# EAGLE design Charge Board (EAGLE 6.3)
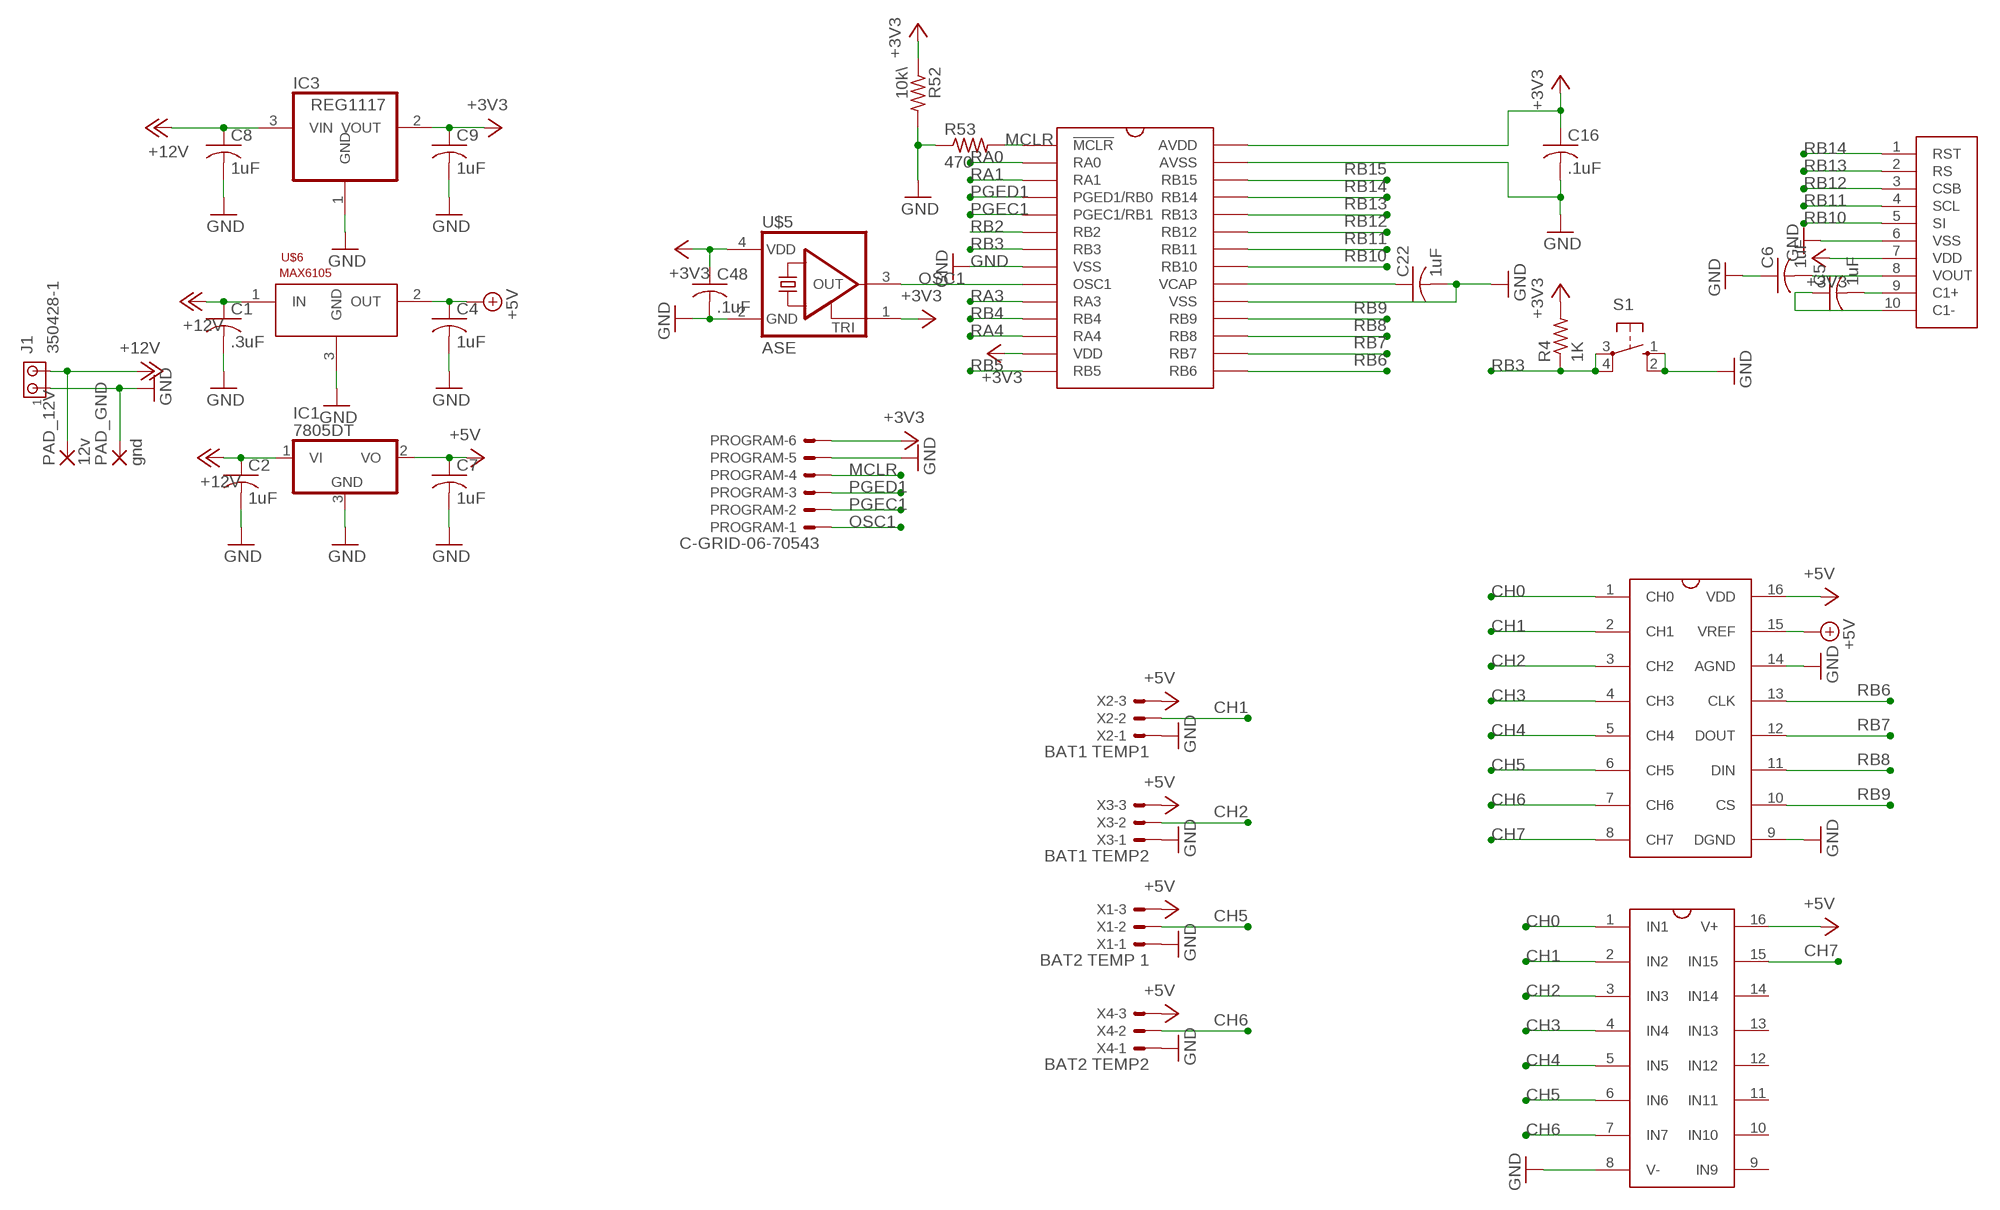
[diagram p0: schematic, sheet 1, part 1 of 2]
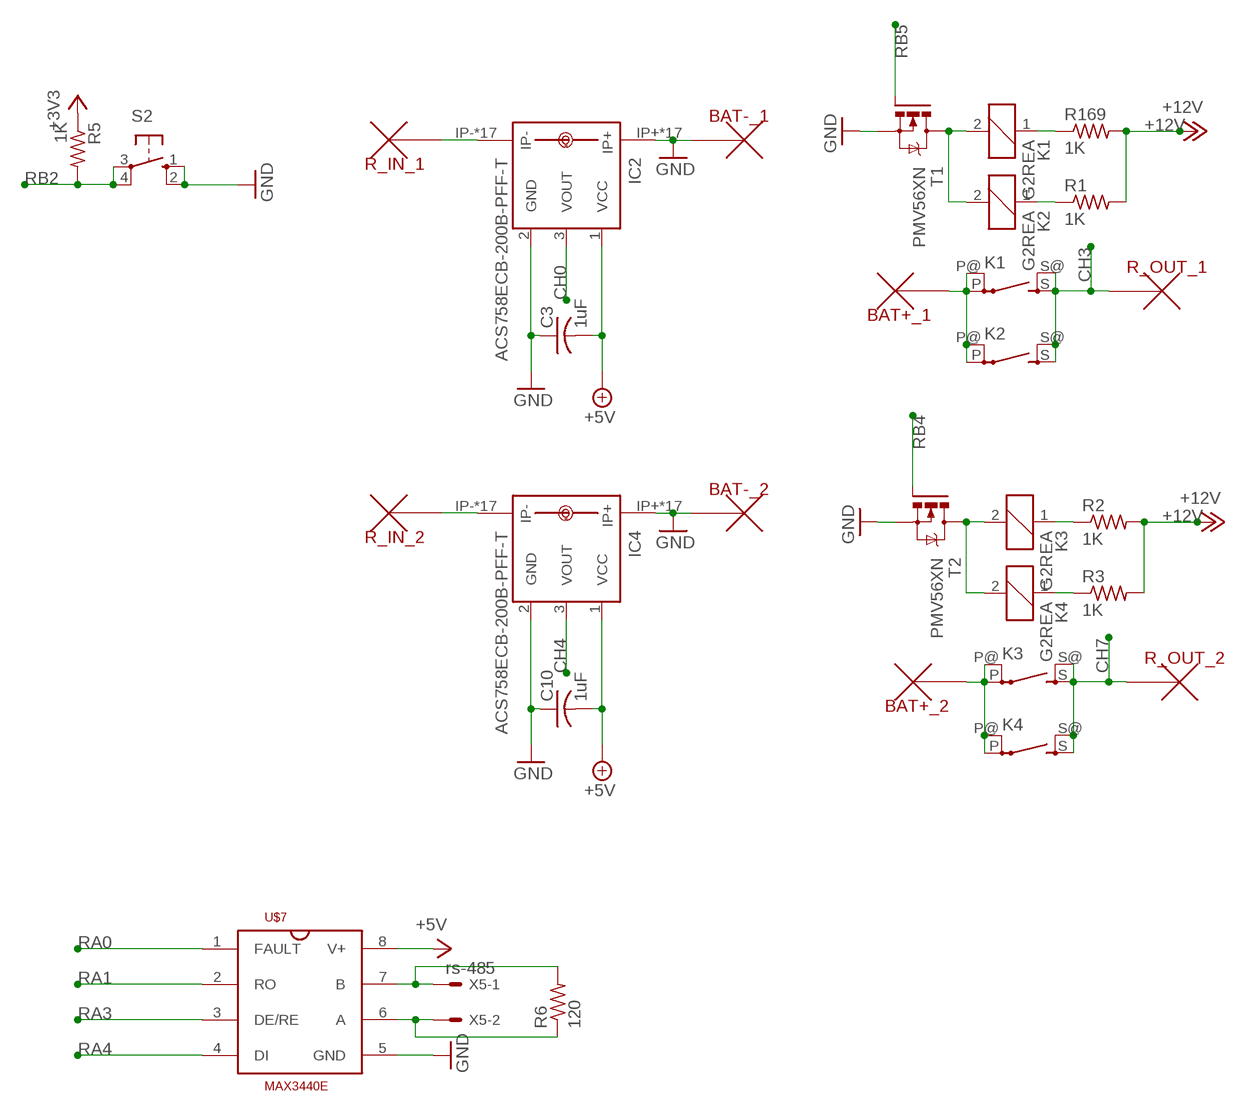
[diagram p1: schematic, sheet 1, part 2 of 2]

## Parts
BAT+_1  BAT1 +  SOLDERPAD  [SOLDERPAD]
BAT+_2  BAT2 +  SOLDERPAD  [SOLDERPAD]
BAT-_1  BAT1 GND  SOLDERPAD  [SOLDERPAD]
BAT-_2  BAT2 GND  SOLDERPAD  [SOLDERPAD]
C1  .3uF  C-USC1206  [C1206]
C2  1uF  C-USC1206  [C1206]
C3  1uF  C-USC1206  [C1206]
C4  1uF  C-USC1206  [C1206]
C5  1uF  C-USC1206  [C1206]
C6  1uF  C-USC1206  [C1206]
C7  1uF  C-USC1206  [C1206]
C8  1uF  C-USC1206  [C1206]
C9  1uF  C-USC1206  [C1206]
C10  1uF  C-USC1206  [C1206]
C16  .1uF  C-USC1206  [C1206]
C22  1uF  C-USC1206  [C1206]
C48  .1uF  C-USC1206  [C1206]
IC1  7805DT  [TO252]
IC2  ACS758ECB-200B-PFF-T  [CB-PFF]
IC3  REG1117  [SOT223]
IC4  ACS758ECB-200B-PFF-T  [CB-PFF]
J1  350428-1  [350428-1]
K1  G2REA  [G2REA]
K2  G2REA  [G2REA]
K3  G2REA  [G2REA]
K4  G2REA  [G2REA]
PAD_12V  12v  3,81/1,4  [3,81/1,4]
PAD_GND  gnd  3,81/1,4  [3,81/1,4]
PROGRAM  C-GRID-06-70543  [70543-06]
R1  1K  R-US_R1206  [R1206]
R2  1K  R-US_R1206  [R1206]
R3  1K  R-US_R1206  [R1206]
R4  1K  R-US_R1206  [R1206]
R5  1K  R-US_R1206  [R1206]
R6  120  R-US_R1206  [R1206]
R52  10k\  R-US_R1206  [R1206]
R53  470  R-US_R1206  [R1206]
R169  1K  R-US_R1206  [R1206]
R_IN_1  R1 IN  SOLDERPAD  [SOLDERPAD]
R_IN_2  R2 IN  SOLDERPAD  [SOLDERPAD]
R_OUT_1  R1 OUT  SOLDERPAD  [SOLDERPAD]
R_OUT_2  R2 OUT  SOLDERPAD  [SOLDERPAD]
S1  10-XX  [B3F-10XX]
S2  10-XX  [B3F-10XX]
T1  PMV56XN  N-CHANNEL_MOSFETPMV56XN,215  [SOT23]
T2  PMV56XN  N-CHANNEL_MOSFETPMV56XN,215  [SOT23]
U$1  MCP-3008  [SO16]
U$2  LCD_SCREEN  [LCD_SCREEN]
U$3  SP720APP  [SO16]
U$4  PIC24HJ128GP-202  [SO28W]
U$5  ASE  [ASE]
U$6  MAX6105  MAX6103  [SOT23]
U$7  MAX3440E  [SO-08]
X1  BAT2 TEMP 1  C-GRID-03-70543  [70543-03]
X2  BAT1 TEMP1  C-GRID-03-70543  [70543-03]
X3  BAT1 TEMP2  C-GRID-03-70543  [70543-03]
X4  BAT2 TEMP2  C-GRID-03-70543  [70543-03]
X5  rs-485  C-GRID-02-70543  [70543-02]

## Nets
+3V3: C9.1 C16.1 C48.1 IC3.2(VOUT) PROGRAM.6 R4.2 R5.1 R52.1 U$2.7(VDD) U$4.13(VDD) U$4.28(AVDD) U$5.1(TRI) U$5.4(VDD)
+5V: C3.2 C4.1 C7.1 C10.2 IC1.2(VO) IC2.1(VCC) IC4.1(VCC) U$1.15(VREF) U$1.16(VDD) U$3.16(V+) U$6.2(OUT) U$7.8(V+) X1.3 X2.3 X3.3 X4.3
+12V: C1.1 C2.1 C8.1 IC1.1(VI) IC3.3(VIN) J1.2 PAD_12V.1(P) R1.2 R2.2 R3.2 R169.2 U$6.1(IN)
CH0: IC2.3(VOUT) U$1.1(CH0) U$3.1(IN1)
CH1: U$1.2(CH1) U$3.2(IN2) X2.2
CH2: U$1.3(CH2) U$3.3(IN3) X3.2
CH3: K1.S(2:S) K1.S@(2:S) K2.S(2:S) K2.S@(2:S) R_OUT_1.P$1 U$1.4(CH3) U$3.4(IN4)
CH4: IC4.3(VOUT) U$1.5(CH4) U$3.5(IN5)
CH5: U$1.6(CH5) U$3.6(IN6) X1.2
CH6: U$1.7(CH6) U$3.7(IN7) X4.2
CH7: K3.S(2:S) K3.S@(2:S) K4.S(2:S) K4.S@(2:S) R_OUT_2.P$1 U$1.8(CH7) U$3.15(IN15)
GND: BAT-_1.P$1 BAT-_2.P$1 C1.2 C2.2 C3.1 C4.2 C6.1 C7.2 C8.2 C9.2 C10.1 C16.2 C22.2 C48.2 IC1.3(GND) IC2.2(GND) IC2.IP+ IC2.IP+@2(IP+) IC2.IP+@3(IP+) IC2.IP+@4(IP+) IC2.IP+@5(IP+) IC2.IP+@6(IP+) IC2.IP+@7(IP+) IC2.IP+@8(IP+) IC2.IP+@9(IP+) IC2.IP+@10(IP+) IC2.IP+@11(IP+) IC2.IP+@12(IP+) IC2.IP+@13(IP+) IC2.IP+@14(IP+) IC2.IP+@15(IP+) IC2.IP+@16(IP+) IC2.IP+@17(IP+) IC3.1(GND) IC4.2(GND) IC4.IP+ IC4.IP+@2(IP+) IC4.IP+@3(IP+) IC4.IP+@4(IP+) IC4.IP+@5(IP+) IC4.IP+@6(IP+) IC4.IP+@7(IP+) IC4.IP+@8(IP+) IC4.IP+@9(IP+) IC4.IP+@10(IP+) IC4.IP+@11(IP+) IC4.IP+@12(IP+) IC4.IP+@13(IP+) IC4.IP+@14(IP+) IC4.IP+@15(IP+) IC4.IP+@16(IP+) IC4.IP+@17(IP+) J1.1 PAD_GND.1(P) PROGRAM.5 R52.2 R53.1 S1.1(S) S1.2(S1) S2.1(S) S2.2(S1) T1.2(S) T2.2(S) U$1.9(DGND) U$1.14(AGND) U$2.6(VSS) U$3.8(V-) U$4.8(VSS) U$4.19(VSS) U$4.27(AVSS) U$5.2(GND) U$6.3(GND) U$7.5(GND) X1.1 X2.1 X3.1 X4.1
MCLR: PROGRAM.4 R53.2 U$4.1(!MCLR!)
N$1: K1.2 K2.2 T1.3(D)
N$2: K2.1 R1.1
N$3: BAT+_2.P$1 K3.P(2:P) K3.P@(2:P) K4.P(2:P) K4.P@(2:P)
N$4: K3.1 R2.1
N$5: K3.2 K4.2 T2.3(D)
N$6: K4.1 R3.1
N$7: IC4.IP- IC4.IP-@2(IP-) IC4.IP-@3(IP-) IC4.IP-@4(IP-) IC4.IP-@5(IP-) IC4.IP-@6(IP-) IC4.IP-@7(IP-) IC4.IP-@8(IP-) IC4.IP-@9(IP-) IC4.IP-@10(IP-) IC4.IP-@11(IP-) IC4.IP-@12(IP-) IC4.IP-@13(IP-) IC4.IP-@14(IP-) IC4.IP-@15(IP-) IC4.IP-@16(IP-) IC4.IP-@17(IP-) R_IN_2.P$1
N$13: IC2.IP- IC2.IP-@2(IP-) IC2.IP-@3(IP-) IC2.IP-@4(IP-) IC2.IP-@5(IP-) IC2.IP-@6(IP-) IC2.IP-@7(IP-) IC2.IP-@8(IP-) IC2.IP-@9(IP-) IC2.IP-@10(IP-) IC2.IP-@11(IP-) IC2.IP-@12(IP-) IC2.IP-@13(IP-) IC2.IP-@14(IP-) IC2.IP-@15(IP-) IC2.IP-@16(IP-) IC2.IP-@17(IP-) R_IN_1.P$1
N$20: C6.2 U$2.8(VOUT)
N$21: C5.2 U$2.9(C1+)
N$22: C5.1 U$2.10(C1-)
N$48: C22.1 U$4.20(VCAP)
N$172: K1.1 R169.1
N$219: R6.2 U$7.7(B) X5.1
N$220: R6.1 U$7.6(A) X5.2
N$278: BAT+_1.P$1 K1.P(2:P) K1.P@(2:P) K2.P(2:P) K2.P@(2:P)
OSC1: PROGRAM.1 U$4.9(OSC1) U$5.3(OUT)
PGEC1: PROGRAM.2 U$4.5(PGEC1/RB1)
PGED1: PROGRAM.3 U$4.4(PGED1/RB0)
RA0: U$4.2(RA0) U$7.1(FAULT)
RA1: U$4.3(RA1) U$7.2(RO)
RA3: U$4.10(RA3) U$7.3(DE/RE)
RA4: U$4.12(RA4) U$7.4(DI)
RB2: R5.2 S2.3(P) S2.4(P1) U$4.6(RB2)
RB3: R4.1 S1.3(P) S1.4(P1) U$4.7(RB3)
RB4: T2.1(G) U$4.11(RB4)
RB5: T1.1(G) U$4.14(RB5)
RB6: U$1.13(CLK) U$4.15(RB6)
RB7: U$1.12(DOUT) U$4.16(RB7)
RB8: U$1.11(DIN) U$4.17(RB8)
RB9: U$1.10(CS) U$4.18(RB9)
RB10: U$2.5(SI) U$4.21(RB10)
RB11: U$2.4(SCL) U$4.22(RB11)
RB12: U$2.3(CSB) U$4.23(RB12)
RB13: U$2.2(RS) U$4.24(RB13)
RB14: U$2.1(RST) U$4.25(RB14)
RB15: U$4.26(RB15)
Unconnected: U$3.9(IN9) U$3.10(IN10) U$3.11(IN11) U$3.12(IN12) U$3.13(IN13) U$3.14(IN14)

## Library data of the parts
BAT+_1 BAT+_2 BAT-_1 BAT-_2 R_IN_1 R_IN_2 R_OUT_1 R_OUT_2 = SolarJackets_Common:SOLDERPAD
C1-C10 C16 C22 C48 = rcl:C-US: CAPACITOR, American symbol
IC1 = linear:78*: Positive VOLTAGE REGULATOR Source: http://cache.national.com/ds/LM/LM78L05.pdf http://www.fairchildsemi.com/ds/LM/LM7805.pdf
IC2 IC4 = allegro:ACS758*: Thermally Enhanced, Fully Integrated, Hall Effect-Based Linear Current Sensor with 100 micro Ohm Current Conductor display layer 49 Reference in BRD and place VIAs on circles Source: http://www.allegromicro.com/en/Products/Part_Numbers/0758/0758.pdf; MPN: ACS758ECB-200B-PFF-T; OC_FARNELL: 1718993; OC_NEWARK: 04R7127
IC3 = burr-brown:REG1117: 800mA and 1A Low Dropout (LDO) Positive Regulator 1.8V, 2.5V, 2.85V, 3.3V, 5V, and Adj; MPN: REG1117; OC_FARNELL: 1097566; OC_NEWARK: 14P6981
J1 = con-amp:350428-1: Universal MATE-N-LOK .250" Centerline, 600 V, 19 - 36 A max Source: http://catalog.tycoelectronics.com/ .. ENG_CD_350428_Y.pdf
K1-K4 = relay:G2REA: RELAY 1 x norm. open, high current, Omron; OC_FARNELL: unknown; OC_NEWARK: unknown
PAD_12V PAD_GND = wirepad:3,81/1,4: THROUGH-HOLE PAD
PROGRAM = con-molex:C-GRID-06: CONNECTOR wire to board 2.54 mm (0.100") pitch header; OC_FARNELL: unknown; OC_NEWARK: unknown
R1-R6 R52 R53 R169 = rcl:R-US_: RESISTOR, American symbol
S1 S2 = switch-omron:10-XX: OMRON SWITCH; MPN: B3F-1000; OC_FARNELL: 176432; OC_NEWARK: 36M3542
T1 T2 = SolarJacketsADC:N-CHANNEL_MOSFET; PART_NUM: PMV56XN,215
U$1 = SolarJackets_Common:MCP-3008
U$2 = LCD_SCREEN:LCD_SCREEN
U$3 = SolarJackets_Common:SP720APP
U$4 = LTC6803:PIC24HJ128GP-202
U$5 = crystal:ASE: 3.3Vdc CMOS SMD CRYSTAL CLOCK OSCILLATOR SOurce: www.abracon.com; OC_FARNELL: unknown; OC_NEWARK: unknown
U$6 = SolarJackets_Common:MAX6103
U$7 = SolarJackets:MAX3440E
X1-X4 = con-molex:C-GRID-03: CONNECTOR wire to board 2.54 mm (0.100") pitch header; OC_FARNELL: unknown; OC_NEWARK: unknown
X5 = con-molex:C-GRID-02: CONNECTOR wire to board 2.54 mm (0.100") pitch header; OC_FARNELL: unknown; OC_NEWARK: unknown

## Board
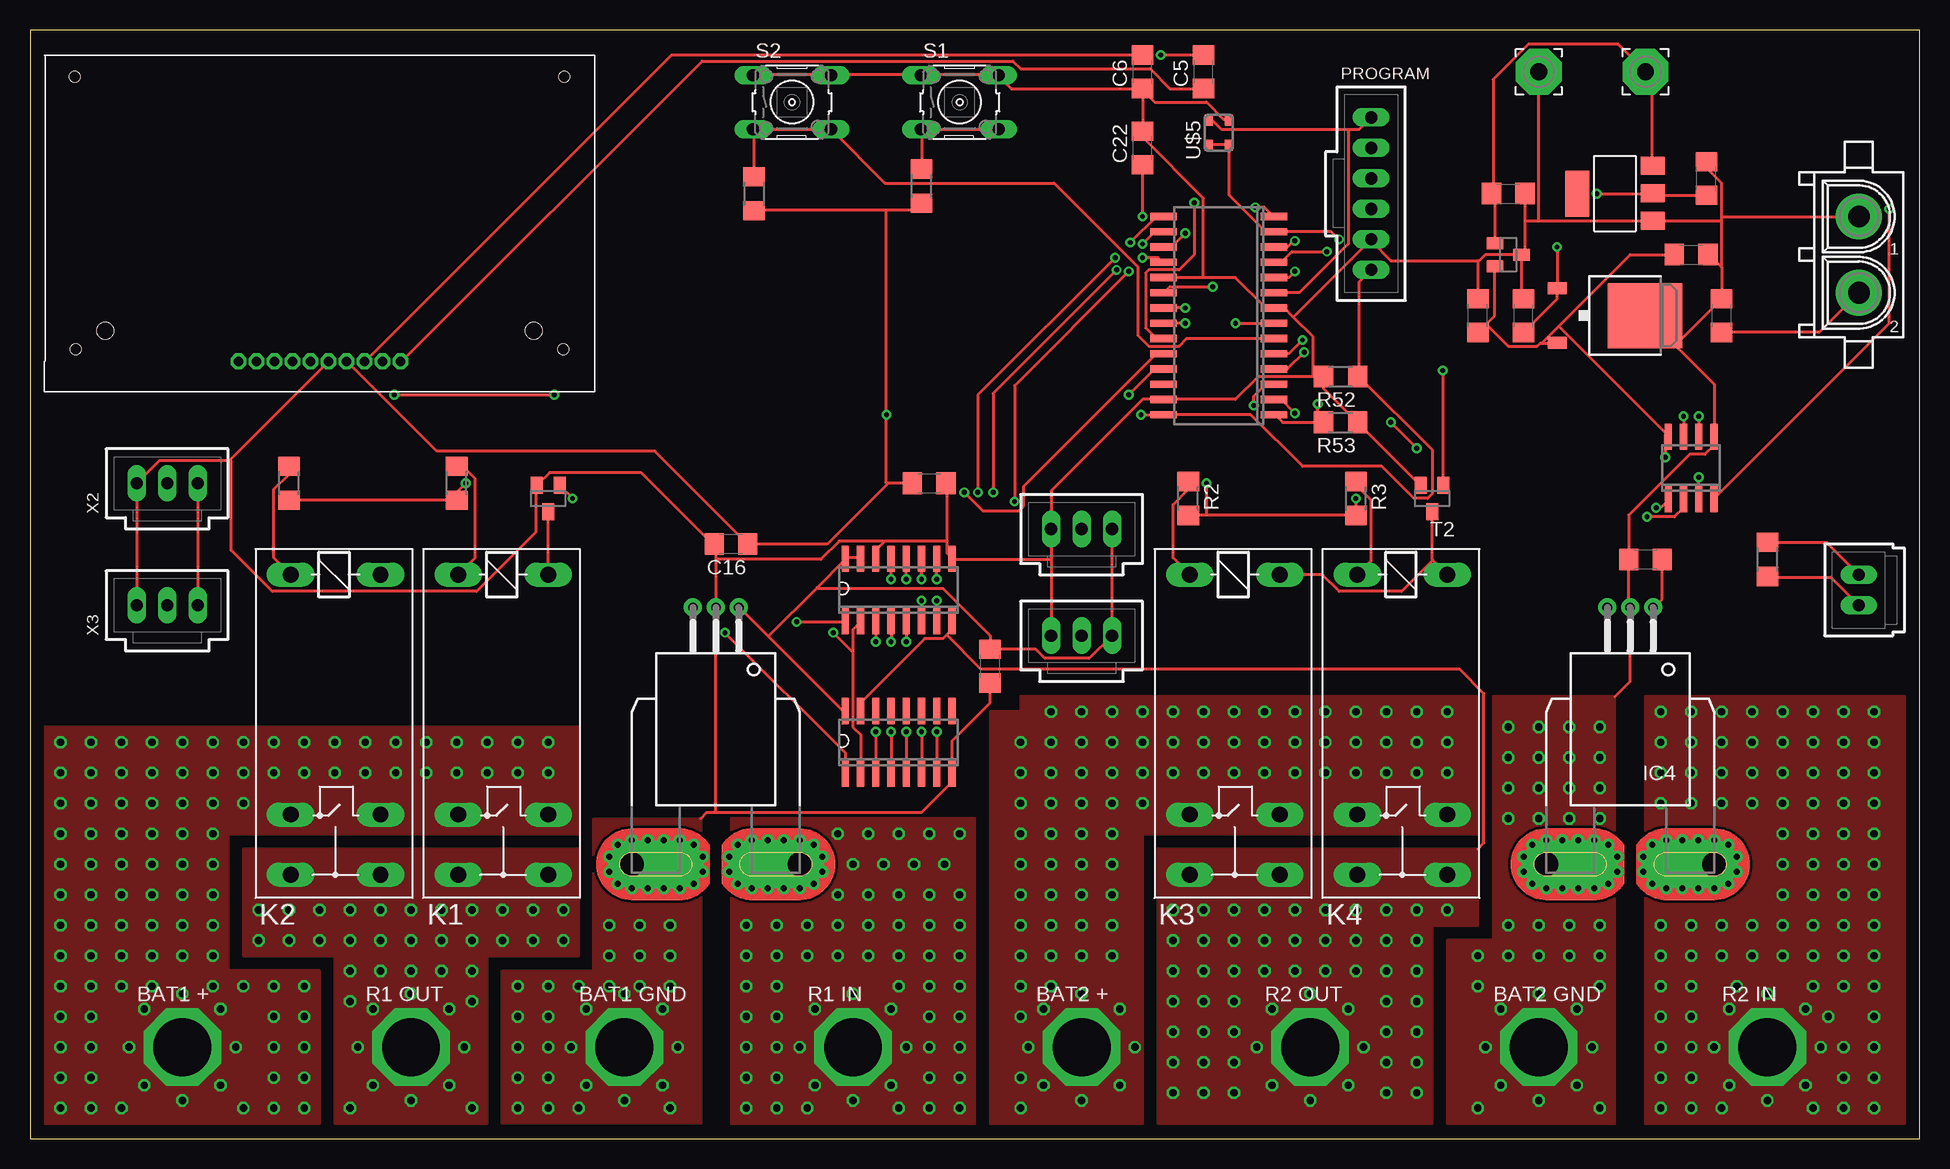
[diagram p2: board, top side]
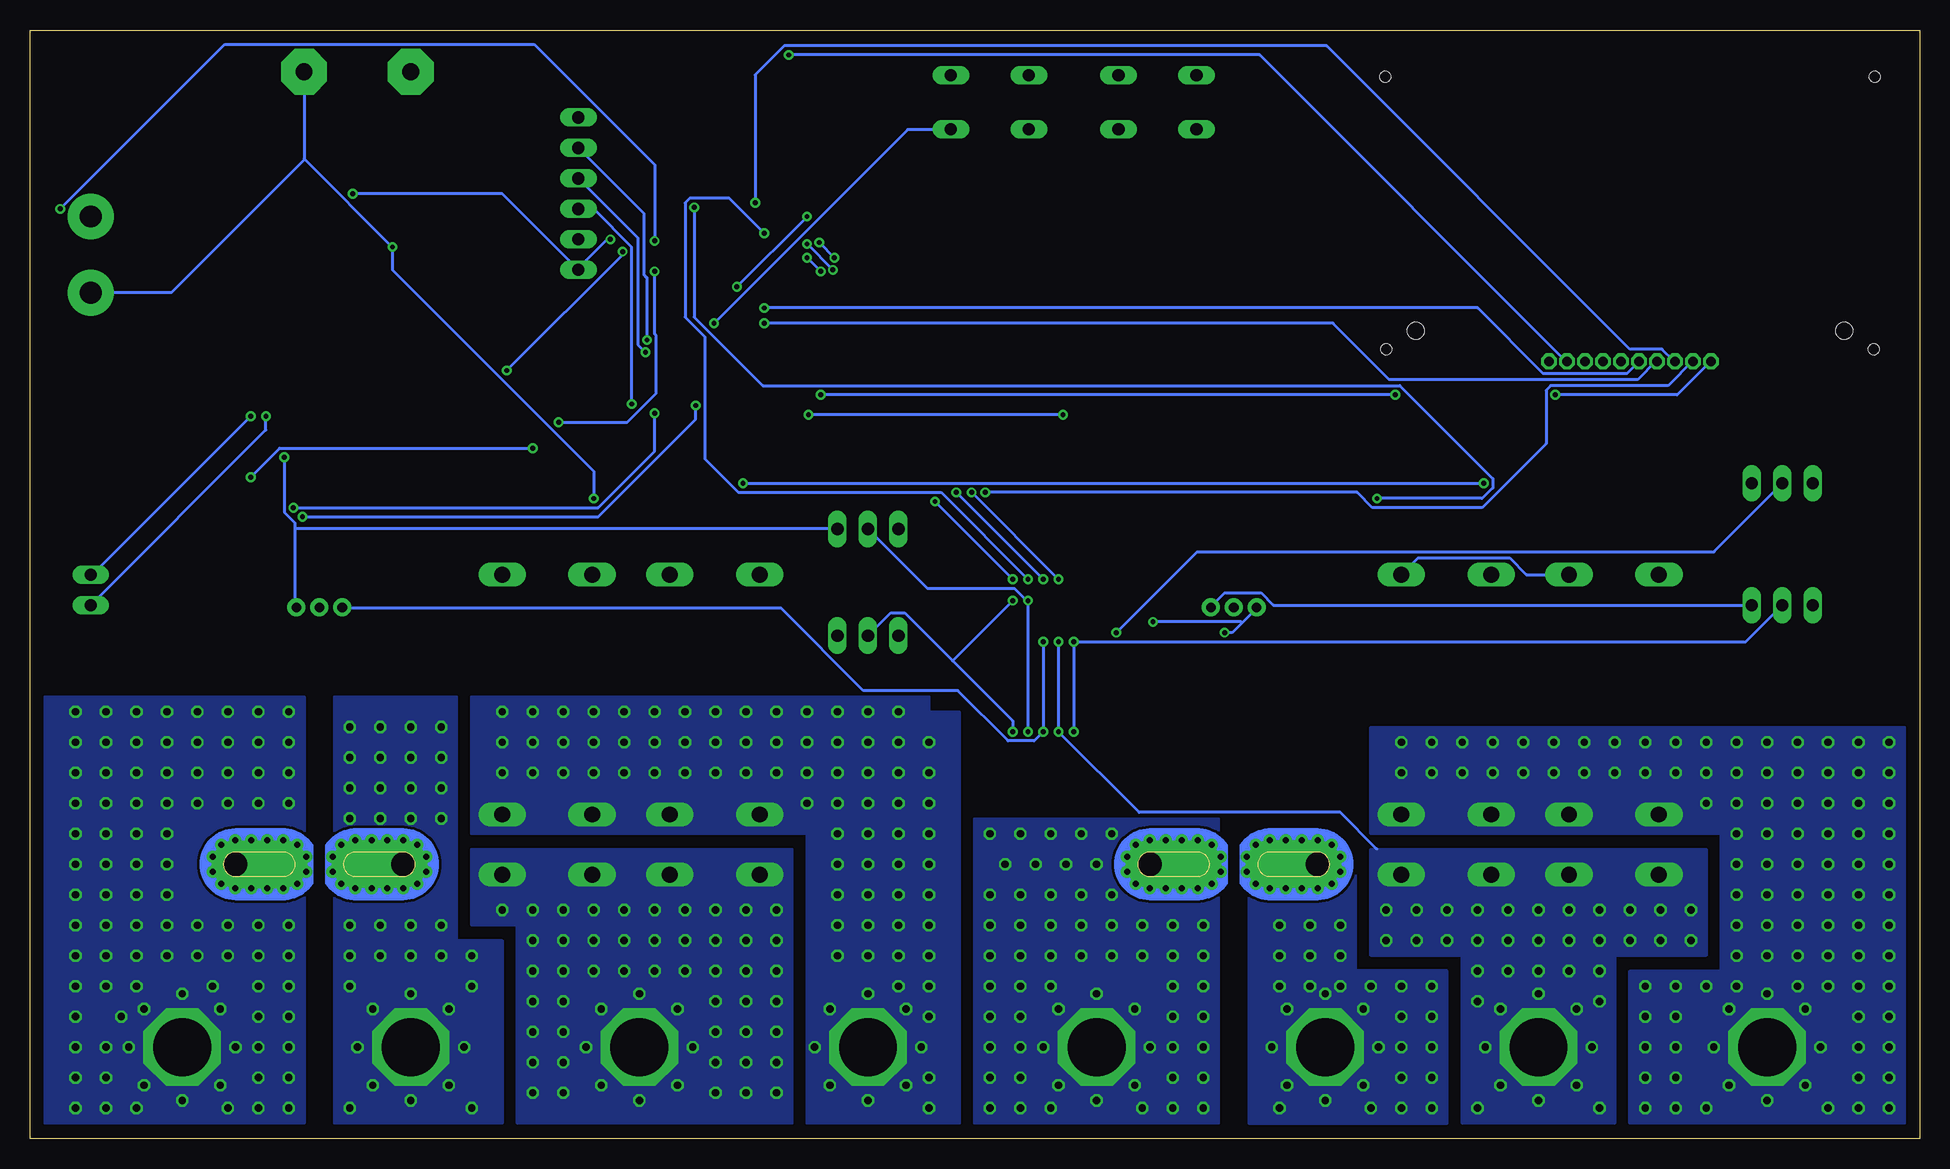
[diagram p3: board, bottom side, seen from below]

Size 157.46 x 92.38 mm. Coordinates in mm from the lower left corner, seen from the top.
Outline: 0,0 157.46,0 157.46,92.38 0,92.38 0,0
Copper layers (1*16): Top 0.035mm / dielectric 1.5mm / Bottom 0.035mm
Design rules "default *": minimum track width 10mil, minimum drill 16mil, track to track 8mil, track to pad 8mil, pad to pad 8mil, via to via 8mil, smd to smd 8mil, copper to edge 40mil, drill to drill 8mil, minimum pad ring 10mil, minimum via ring 8mil, stop-mask expansion 4mil, vias tented up to drill 0mil, thermal gap 0mil

### Footprints (pad centres in the part's own frame; a part is rotated, then mirrored left to right if it is on the bottom)
SOLDERPAD = drill 4.826 pad 6.452 octagon: P$1 0,0
C1206 = smd 1.6 x 1.8: 1 -1.4,0; 2 1.4,0
TO252 = smd 1 x 1.6: 1 -2.28,-4.8; 2 2.28,-4.8 | smd 5.4 x 6.2: 3 0,2.5
CB-PFF = drill 0.8 pad 1.5: 1 -1.91,-21.4; 2 0,-21.4; 3 1.91,-21.4 | drill 2 pad 4 offset: IP+ 7,0; IP- -7,0 | drill 0.5 pad 0.9: IP+@2 8.89,0.635; IP+@3 8.89,-0.635; IP+@4 8.175,-1.625; IP+@5 7,-2; IP+@6 5.675,-2; IP+@7 4.35,-2; IP+@8 3,-2; IP+@9 1.825,-1.625; IP+@10 1.1,-0.625; IP+@11 1.1,0.625; IP+@12 1.825,1.625; IP+@13 3,2; IP+@14 4.35,2; IP+@15 5.675,2; IP+@16 7,2; IP+@17 8.175,1.625; IP-@2 -8.89,0.635; IP-@3 -8.89,-0.635; IP-@4 -8.175,-1.625; IP-@5 -7,-2; IP-@6 -5.675,-2; IP-@7 -4.325,-2; IP-@8 -3,-2; IP-@9 -1.825,-1.625; IP-@10 -1.1,-0.625; IP-@11 -1.1,0.625; IP-@12 -1.825,1.625; IP-@13 -3,2; IP-@14 -4.325,2; IP-@15 -5.675,2; IP-@16 -7,2; IP-@17 -8.175,1.625
SOT223 = smd 1.499 x 2.007: 1 -2.261,-3.15; 2 0.025,-3.15; 3 2.311,-3.15 | smd 3.81 x 2.007: 4 0,3.15
350428-1 = drill 1.8 pad 3.81: 1 -3.175,0; 2 3.175,0
G2REA = drill 1.321 long: 1 -2.54,-3.683; 2 -2.54,3.81; P 17.45,-3.683; P@ 17.45,3.81; S 22.454,-3.683; S@ 22.454,3.81
3,81/1,4 = drill 1.397 pad 3.81 octagon: 1 0,0
70543-06 = drill 1.016 long: 1 -6.35,0; 2 -3.81,0; 3 -1.27,0; 4 1.27,0; 5 3.81,0; 6 6.35,0
R1206 = smd 1.6 x 1.803: 1 -1.422,0; 2 1.422,0
B3F-10XX = drill 1.016 long: 1 -3.251,2.261; 2 3.251,2.261; 3 -3.251,-2.261; 4 3.251,-2.261
SOT23 = smd 1 x 1.4: 1 -0.95,-1.1; 2 0.95,-1.1; 3 0,1.1
SO16 = smd 0.6 x 2.2: 1 -4.445,-2.6; 2 -3.175,-2.6; 3 -1.905,-2.6; 4 -0.635,-2.6; 5 0.635,-2.6; 6 1.905,-2.6; 7 3.175,-2.6; 8 4.445,-2.6; 9 4.445,2.6; 10 3.175,2.6; 11 1.905,2.6; 12 0.635,2.6; 13 -0.635,2.6; 14 -1.905,2.6; 15 -3.175,2.6; 16 -4.445,2.6
LCD_SCREEN = drill 0.8 octagon: 1 -6.75,0; 2 -5.25,0; 3 -3.75,0; 4 -2.25,0; 5 -0.75,0; 6 0.75,0; 7 2.25,0; 8 3.75,0; 9 5.25,0; 10 6.75,0 | hole 0.9: 20.3,1; -20.3,1; 20.4,23.7; -20.4,23.7 | hole 1.4: 17.85,2.55; -17.85,2.55
SO28W = smd 0.6 x 2.2: 1 -8.255,-4.6; 2 -6.985,-4.6; 3 -5.715,-4.6; 4 -4.445,-4.6; 5 -3.175,-4.6; 6 -1.905,-4.6; 7 -0.635,-4.6; 8 0.635,-4.6; 9 1.905,-4.6; 10 3.175,-4.6; 11 4.445,-4.6; 12 5.715,-4.6; 13 6.985,-4.6; 14 8.255,-4.6; 15 8.255,4.6; 16 6.985,4.6; 17 5.715,4.6; 18 4.445,4.6; 19 3.175,4.6; 20 1.905,4.6; 21 0.635,4.6; 22 -0.635,4.6; 23 -1.905,4.6; 24 -3.175,4.6; 25 -4.445,4.6; 26 -5.715,4.6; 27 -6.985,4.6; 28 -8.255,4.6
ASE = smd 0.9 x 0.65: 1 -1.05,-0.825; 2 1.05,-0.825; 3 1.05,0.825; 4 -1.05,0.825
SO-08 = smd 0.6 x 2.2: 1 -1.905,-2.6; 2 -0.635,-2.6; 3 0.635,-2.6; 4 1.905,-2.6; 5 1.905,2.6; 6 0.635,2.6; 7 -0.635,2.6; 8 -1.905,2.6
70543-03 = drill 1.016 long: 1 -2.54,0; 2 0,0; 3 2.54,0
70543-02 = drill 1.016 long: 1 -1.27,0; 2 1.27,0

### Placement (x,y rotation side)
BAT+_1  12.7,7.62 0 top
BAT+_2  87.63,7.62 0 top
BAT-_1  49.53,7.62 0 top
BAT-_2  125.73,7.62 0 top
C1  123.19,78.74 0 top
C2  124.46,68.58 90 top
C3  134.62,48.26 0 top
C4  120.65,68.58 90 top
C5  97.79,88.9 90 top
C6  92.71,88.9 90 top
C7  138.43,73.66 0 top
C8  140.97,68.58 90 top
C9  139.7,80.01 90 top
C10  80.01,39.37 90 top
C16  58.42,49.53 180 top
C22  92.71,82.55 90 top
C48  74.93,54.61 0 top
IC1  132.08,68.58 270 top
IC2  57.15,22.86 180 top
IC3  132.08,78.74 90 top
IC4  133.35,22.86 180 top
J1  152.4,73.66 270 top
K1  39.37,44.45 270 top
K2  25.4,44.45 270 top
K3  100.33,44.45 270 top
K4  114.3,44.45 270 top
PAD_12V  134.62,88.9 180 top
PAD_GND  125.73,88.9 180 top
PROGRAM  111.76,78.74 270 top
R1  21.59,54.61 270 top
R2  96.52,53.34 270 top
R3  110.49,53.34 270 top
R4  74.3,79.38 270 top
R5  60.33,78.74 90 top
R6  144.78,48.26 270 top
R52  109.22,63.5 180 top
R53  109.22,59.69 180 top
R169  35.56,54.61 270 top
R_IN_1  68.58,7.62 0 top
R_IN_2  144.78,7.62 0 top
R_OUT_1  31.75,7.62 0 top
R_OUT_2  106.68,7.62 0 top
S1  77.47,86.36 0 top
S2  63.5,86.36 0 top
T1  43.18,53.34 180 top
T2  116.84,53.34 180 top
U$1  72.39,45.72 0 top
U$2  24.13,64.77 0 top
U$3  72.39,33.02 0 top
U$4  99.06,68.58 90 top
U$5  99.06,83.82 90 top
U$6  123.19,73.66 270 top
U$7  138.43,55.88 0 top
X1  87.63,50.8 0 top
X2  11.43,54.61 0 top
X3  11.43,44.45 0 top
X4  87.63,41.91 0 top
X5  152.4,45.72 90 top

### Tracks (layer width: path | path; a pad name or v marks a point on that pad's centre or on a via)
+3V3  (via drill 0.41)
  Top 0.254: U$5.4 98.3,82.8 99.82,82.8 U$5.1 99.95,82.68 99.95,78.61 103,75.56 U$4.13 108.46,75.56 v109.09,74.93 | C9.1 135.38,78.61 IC3.2 135.13,78.74 v130.56,78.74 | 110.74,63.5 110.74,71.37 PROGRAM.6 | 110.74,63.5 116.84,57.4 116.84,53.72 116.46,53.34 115.32,53.34 112.65,56.01 106.05,56.01 101.73,60.33 U$4.28 v92.58,60.33 | 110.74,63.5 R52.1 | 71.37,77.34 73.79,77.34 74.3,77.85 R4.2 | 71.37,77.34 60.33,77.34 R5.1 | 71.44,54.55 71.5,54.61 C48.1 | 71.44,54.55 66.42,49.53 C16.1 52.07,57.28 33.91,57.28 26.42,64.77 U$2.7 | 71.37,77.34 v71.37,60.33 71.37,54.61 71.44,54.55
  Bottom 0.254: v130.56,78.74 118.11,78.74 PROGRAM.6 111.76,72.52 109.35,74.93 v109.09,74.93 | v71.37,60.33 v92.58,60.33
+5V  (via drill 0.41)
  Top 0.254: C3.2 136.02,44.96 135.38,44.32 IC4.1 | U$6.2 122.05,72.64 122.05,68.58 C4.1 121.41,67.82 123.19,66.04 125.6,66.04 125.86,66.29 125.98,66.29 | 125.98,66.29 127.25,66.29 IC1.2 | C7.1 133.35,73.66 127.38,67.69 | 125.98,66.29 127.38,67.69 | 127.38,67.69 136.53,58.55 U$7.8 136.27,58.67 v136.27,56.77 | X1.3 X4.3 88.27,40.01 84.58,40.01 83.82,40.77 C10.2 80.01,41.91 76.07,45.85 65.66,45.85 65.6,45.91 | X2.3 X3.3 | U$1.15 69.22,48.39 67.94,48.39 U$1.16 67.94,48.26 65.6,45.91 | 61.53,41.85 59.18,44.2 IC2.1 | 61.53,41.85 67.69,35.69 67.94,35.69 U$3.16 | 61.53,41.85 65.6,45.91
  Bottom 0.254: 135.38,50.8 135.38,51.31 136.27,52.2 v136.27,56.77 | 135.38,50.8 135.38,44.32 IC4.1 | X3.3 53.85,44.45 54.86,45.47 57.91,45.47 59.05,44.32 IC2.1 | X1.3 135.38,50.8
+12V  (via drill 0.41)
  Top 0.254: J1.2 149.1,67.18 C8.1 | 35.56,53.21 21.59,53.21 R1.2 | 110.49,51.94 98.04,51.94 | 98.04,51.94 96.52,51.94 R2.2 | C2.1 127.25,69.98 127.25,70.74 IC1.1 127.25,70.99 v127.25,74.3 | U$6.1 122.05,74.68 122.05,78.49 C1.1 121.92,78.74 121.92,88.27 124.84,91.19 132.33,91.19 PAD_12V.1 135.13,88.39 135.13,81.15 IC3.3 | v110.49,53.34 110.49,51.94 | 110.49,51.94 R3.2 | 35.56,53.21 35.56,53.85 v36.32,54.61 | 98.04,51.94 v98.04,54.61 | 35.56,53.21 R169.2
  Bottom 0.254: 134.56,81.6 134.62,81.66 PAD_12V.1 | 134.56,81.6 v127.25,74.3 127.25,72.39 110.49,55.63 v110.49,53.34 | v98.04,54.61 v36.32,54.61 | J1.2 145.67,70.48 134.56,81.6
CH0  (via drill 0.41)
  Top 0.254: U$3.1 67.94,32.13 v57.91,42.16 | v63.88,43.05 67.94,43.05 U$1.1
  Bottom 0.254: v57.91,42.16 57.28,42.16 56.45,42.99 | 56.45,42.99 55.24,44.2 IC2.3 | v63.88,43.05 56.52,43.05 56.45,42.99
CH1  (via drill 0.41)
  Top 0.254: U$3.2 69.22,33.66 68.58,34.29 68.58,40.51 | 68.58,40.51 68.58,42.42 69.22,43.05 U$1.2 | 68.58,40.51 v66.93,42.16
  Bottom 0.254: X2.2 17.14,48.9 60.2,48.9 v66.93,42.16
CH2  (via drill 0.41)
  Top 0.254: v70.48,33.91 U$3.3 | U$1.3 v70.48,41.4
  Bottom 0.254: v70.48,33.91 v70.48,41.4 14.48,41.4 X3.2
CH3  (via drill 0.41, 0.61)
  Top 0.254: v71.75,33.91 U$3.4 | U$1.4 v71.75,41.4
  Bottom 0.254: v71.75,41.4 v71.75,33.91 65.02,27.18 48.26,27.18 45.21,24.13
  other vias: 19.05,19.05 19.05,16.51 21.59,16.51 21.59,19.05 24.13,19.05 24.13,16.51 26.67,16.51 26.67,19.05 31.75,12.06 28.57,10.79 28.57,4.45 34.92,4.45 34.92,10.79 36.2,7.62 27.3,7.62 31.75,3.17 29.21,19.05 29.21,16.51 31.75,16.51 31.75,19.05 34.29,19.05 36.83,19.05 39.37,19.05 41.91,19.05 44.45,19.05 44.45,16.51 41.91,16.51 39.37,16.51 36.83,16.51 34.29,16.51 26.67,13.97 29.21,13.97 31.75,13.97 34.29,13.97 36.83,13.97 26.67,2.54 36.83,2.54 36.83,11.43 26.67,11.43
  pour Top: 45.72,24.13 17.78,24.13 17.78,15.24 25.4,15.24 25.4,1.27 38.1,1.27 38.1,15.24 45.72,15.24
  pour Top: 45.72,24.13 17.78,24.13 17.78,15.24 25.4,15.24 25.4,1.27 38.1,1.27 38.1,15.24 45.72,15.24
  pour Bottom: 45.72,24.13 17.78,24.13 17.78,15.24 25.4,15.24 25.4,1.27 38.1,1.27 38.1,15.24 45.72,15.24
CH4  (via drill 0.41)
  Top 0.254: v73.03,33.91 U$3.5 | U$1.5 v73.03,41.4
  Bottom 0.254: v73.03,41.4 v73.03,33.91 73.79,33.15 75.95,33.15 80.14,37.34 88.01,37.34 94.87,44.2 131.32,44.2 IC4.3
CH5  (via drill 0.41)
  Top 0.254: v74.3,33.91 U$3.6 | v74.3,44.83 U$1.6
  Bottom 0.254: v74.3,33.91 74.3,44.7 74.36,44.77 | 74.36,44.77 75.44,45.85 82.68,45.85 X1.2 | v74.3,44.83 74.36,44.77
CH6  (via drill 0.41)
  Top 0.254: v75.56,33.91 U$3.7 | v75.56,44.83 U$1.7
  Bottom 0.254: v75.56,33.91 75.56,34.8 80.58,39.81 | 80.58,39.81 84.58,43.81 85.72,43.81 X4.2 | 80.58,39.81 v75.56,44.83
CH7  (via drill 0.61)
  Top 0.254: U$3.15 69.22,36.32 74.55,41.66 76.07,41.66 76.39,41.97 | 76.39,41.97 76.83,42.42 U$1.8 | 76.39,41.97 79.25,39.12 119.13,39.12 121.16,37.08 121.16,24.64 120.65,24.13
  other vias: 95.25,19.05 97.79,19.05 100.33,19.05 102.87,19.05 105.41,19.05 107.95,19.05 110.49,19.05 113.03,19.05 115.57,19.05 118.11,19.05 115.57,16.51 113.03,16.51 110.49,16.51 107.95,16.51 105.41,16.51 102.87,16.51 100.33,16.51 97.79,16.51 95.25,16.51 106.68,12.06 103.5,10.79 103.5,4.45 102.23,7.62 111.12,7.62 109.86,4.45 106.68,3.17 109.86,10.79 95.25,13.97 97.79,13.97 100.33,13.97 102.87,13.97 105.41,13.97 107.95,13.97 110.49,13.97 113.03,13.97 115.57,13.97 95.25,11.43 97.79,11.43 100.33,11.43 100.33,8.89 97.79,8.89 95.25,8.89 95.25,6.35 97.79,6.35 100.33,6.35 100.33,3.81 97.79,3.81 95.25,3.81 113.03,11.43 115.57,11.43 115.57,8.89 113.03,8.89 113.03,6.35 115.57,6.35 115.57,3.81 113.03,3.81
  pour Top: 93.98,24.13 93.98,1.27 116.84,1.27 116.84,17.78 120.65,17.78 120.65,24.13
  pour Top: 93.98,24.13 93.98,1.27 116.84,1.27 116.84,17.78 120.65,17.78 120.65,24.13
  pour Bottom: 93.98,24.13 93.98,1.27 116.84,1.27 116.84,17.78 120.65,17.78 120.65,24.13
GND  (via drill 0.61)
  Top 0.254: 16.7,56.58 16.64,56.52 10.79,56.52 X2.1 X3.1 | 16.7,56.58 24.38,64.26 24.38,64.39 24.77,64.77 U$2.6 | 57.15,48.26 57.15,49.4 C16.2 56.9,49.53 50.93,55.5 43.31,55.5 42.29,54.48 T1.2 42.16,54.36 42.16,50.55 37.21,45.59 20.19,45.59 16.76,49.02 16.76,56.52 16.7,56.58 | 57.15,48.26 IC2.2 57.15,27.18 | C10.1 80.01,36.32 76.83,33.15 U$3.8 76.83,29.72 74.3,27.18 57.15,27.18 | 57.15,27.18 56.39,27.18 55.88,26.67 | C3.1 133.22,44.45 133.35,44.32 IC4.2 133.35,38.1 132.08,36.83 | C3.1 133.22,51.94 138.3,57.02 139.57,57.02 140.34,57.78 U$7.5 140.34,62.87 134.62,68.58 IC1.3 137.16,66.17 C8.2 140.97,72.64 140.91,72.71 | C3.1 | 124.33,73.66 124.33,70.23 124.46,70.1 C2.2 | C4.2 120.65,73.03 120.71,73.09 | 120.71,73.09 121.28,73.66 U$6.3 124.33,73.66 | 124.59,76.45 124.59,73.91 124.33,73.66 | 124.59,76.45 C1.2 | 140.91,72.71 139.95,73.66 C7.2 | C9.2 139.7,80.9 140.97,79.63 140.97,76.83 | 140.97,76.45 140.97,72.77 140.91,72.71 | 140.97,76.45 140.97,76.83 | 140.97,76.45 135.25,76.45 IC3.1 135.13,76.45 125.73,76.45 | 125.73,76.45 124.59,76.45 | 140.97,76.83 J1.1 | 125.73,76.45 PAD_GND.1 | S2.1 60.33,88.65 66.67,88.65 S2.2 66.8,88.65 74.17,88.65 S1.1 74.3,88.65 80.64,88.65 S1.2 80.77,88.52 81.79,87.5 C6.1 | U$5.2 99.82,84.96 99.44,84.96 98.04,86.36 93.73,86.36 92.71,87.38 C6.1 | C6.1 C22.2 92.71,83.44 97.79,78.36 97.79,71.75 | 85.09,48.26 X1.1 85.09,53.98 92.71,61.59 U$4.27 100.46,61.59 102.36,63.5 106.93,63.5 | 85.09,48.26 X4.1 | 76.45,49.78 76.45,48.77 76.83,48.39 U$1.9 76.83,48.26 85.09,48.26 | 76.45,49.78 76.45,54.61 C48.2 | U$1.14 70.48,49.02 71.18,49.72 | 71.18,49.72 71.25,49.78 76.45,49.78
  Top 0.254: 110.62,59.69 115.82,54.48 T2.2 | 110.62,59.69 107.82,62.48 107.82,63.5 R52.2 106.93,63.5 | 110.62,59.69 R53.1 | 105.28,68.45 106.93,66.8 106.93,63.5 | 105.28,68.45 104.52,69.22 U$4.8 103,69.22 100.46,71.75 97.79,71.75 | 97.79,71.75 U$4.19 | 105.28,68.45 PROGRAM.5 111.76,74.8 113.41,73.15 120.65,73.15 120.71,73.09 | 57.15,48.26 65.91,48.26 67.44,49.78 71.12,49.78 71.18,49.72
  other vias: 48.26,17.78 50.8,17.78 53.34,17.78 48.26,15.24 50.8,15.24 53.34,15.24 53.34,12.7 50.8,12.7 48.26,12.7 46.35,10.79 49.53,12.06 52.7,10.79 53.98,7.62 49.53,3.17 45.09,7.62 46.35,4.45 52.7,4.45 128.91,10.79 125.73,12.06 122.56,10.79 121.28,7.62 125.73,3.17 122.56,4.45 128.91,4.45 130.18,7.62 45.72,12.7 43.18,12.7 40.64,12.7 40.64,10.16 43.18,10.16 43.18,7.62 40.64,7.62 40.64,5.08 43.18,5.08 43.18,2.54 40.64,2.54 45.72,2.54 53.34,2.54 123.19,34.29 125.73,34.29 128.27,34.29 130.81,34.29 130.81,31.75 128.27,31.75 125.73,31.75 123.19,31.75 123.19,29.21 125.73,29.21 128.27,29.21 130.81,29.21 130.81,26.67 128.27,26.67 125.73,26.67 123.19,26.67 123.19,17.78 125.73,17.78 128.27,17.78 130.81,17.78 130.81,15.24 128.27,15.24 125.73,15.24 123.19,15.24 120.65,15.24 120.65,12.7 130.81,12.7 120.65,2.54 130.81,2.54
  pour Top: 55.88,1.27 39.37,1.27 39.37,13.97 46.99,13.97 46.99,26.67 55.88,26.67
  pour Top: 132.08,1.27 132.08,36.83 121.92,36.83 121.92,16.51 118.11,16.51 118.11,1.27
  pour Top: 55.88,1.27 39.37,1.27 39.37,13.97 46.99,13.97 46.99,26.67 55.88,26.67
  pour Top: 132.08,1.27 132.08,36.83 121.92,36.83 121.92,16.51 118.11,16.51 118.11,1.27
  pour Bottom: 55.88,1.27 39.37,1.27 39.37,13.97 46.99,13.97 46.99,26.67 55.88,26.67
  pour Bottom: 132.08,1.27 132.08,36.83 121.92,36.83 121.92,16.51 118.11,16.51 118.11,1.27
MCLR  (via drill 0.41)
  Top 0.254: 107.31,59.69 104.39,59.69 103.76,60.33 U$4.1 | 107.31,59.69 R53.2 107.7,59.69 | 107.31,59.69 v107.31,61.21
  Bottom 0.254: PROGRAM.4 110.49,77.47 107.31,74.3 v107.31,61.21
N$1
  Top 0.254: K1.2 T1.3
  Bottom 0.254: K2.2 32.77,46.99 34.16,48.39 41.78,48.39 K1.2
N$2
  Top 0.254: R1.1 21.59,55.37 20.32,54.1 20.32,48.39 K2.1
N$3  (via drill 0.61)
  other vias: 85.09,35.56 87.63,35.56 90.17,35.56 92.71,35.56 95.25,35.56 97.79,35.56 100.33,35.56 102.87,35.56 105.41,35.56 107.95,35.56 110.49,35.56 113.03,35.56 115.57,35.56 118.11,35.56 85.09,33.02 87.63,33.02 90.17,33.02 92.71,33.02 97.79,33.02 95.25,33.02 100.33,33.02 102.87,33.02 105.41,33.02 107.95,33.02 110.49,33.02 113.03,33.02 115.57,33.02 118.11,33.02 118.11,30.48 115.57,30.48 113.03,30.48 110.49,30.48 107.95,30.48 105.41,30.48 102.87,30.48 100.33,30.48 97.79,30.48 95.25,30.48 92.71,30.48 90.17,30.48 87.63,30.48 85.09,30.48 82.55,30.48 82.55,33.02 82.55,27.94 82.55,25.4 85.09,25.4 85.09,27.94 87.63,27.94 90.17,27.94 92.71,27.94 87.63,25.4 90.17,25.4 82.55,22.86 82.55,20.32 82.55,17.78 82.55,15.24 82.55,12.7 87.63,12.06 90.81,10.79 92.08,7.62 90.81,4.45 87.63,3.17 84.45,4.45 83.19,7.62 84.45,10.79 82.55,10.16 82.55,5.08 82.55,2.54 85.09,22.86 85.09,20.32 85.09,17.78 85.09,15.24 85.09,12.7 87.63,22.86 87.63,20.32 87.63,17.78 87.63,15.24 90.17,22.86 90.17,20.32 90.17,17.78 90.17,15.24
  pour Top: 95.25,25.4 120.65,25.4 120.65,36.83 82.55,36.83 82.55,35.56 80.01,35.56 80.01,34.29 80.01,1.27 92.71,1.27 92.71,25.4
  pour Top: 95.25,25.4 120.65,25.4 120.65,36.83 82.55,36.83 82.55,35.56 80.01,35.56 80.01,34.29 80.01,1.27 92.71,1.27 92.71,25.4
  pour Bottom: 95.25,25.4 120.65,25.4 120.65,36.83 82.55,36.83 82.55,35.56 80.01,35.56 80.01,34.29 80.01,1.27 92.71,1.27 92.71,25.4
N$4
  Top 0.254: R2.1 96.52,54.1 95.25,52.83 95.25,48.39 K3.1
N$5
  Top 0.254: T2.3 116.84,48.26 116.9,48.2 | K4.2 116.9,48.2 | K3.2 107.7,46.99 109.09,45.59 114.3,45.59 116.9,48.2
N$6
  Top 0.254: R3.1 110.49,54.48 111.76,53.21 111.76,48.13 K4.1
N$7  (via drill 0.61)
  other vias: 135.89,35.56 138.43,35.56 140.97,35.56 143.51,35.56 146.05,35.56 148.59,35.56 151.13,35.56 153.67,35.56 153.67,33.02 151.13,33.02 148.59,33.02 146.05,33.02 143.51,33.02 140.97,33.02 138.43,33.02 135.89,33.02 135.89,30.48 138.43,30.48 140.97,30.48 143.51,30.48 146.05,30.48 148.59,30.48 151.13,30.48 153.67,30.48 153.67,27.94 151.13,27.94 148.59,27.94 146.05,27.94 143.51,27.94 140.97,27.94 138.43,27.94 135.89,27.94 146.05,25.4 146.05,22.86 146.05,20.32 146.05,17.78 143.51,17.78 140.97,17.78 138.43,17.78 135.89,17.78 148.59,17.78 151.13,17.78 153.67,17.78 153.67,20.32 153.67,22.86 153.67,25.4 151.13,25.4 148.59,25.4 148.59,22.86 151.13,22.86 151.13,20.32 148.59,20.32 144.78,12.06 141.6,10.79 140.34,7.62 141.6,4.45 144.78,3.17 147.96,4.45 149.22,7.62 147.96,10.79 135.89,15.24 138.43,15.24 140.97,15.24 143.51,15.24 146.05,15.24 148.59,15.24 151.13,15.24 153.67,15.24 153.67,12.7 151.13,12.7 148.59,12.7 138.43,12.7 135.89,12.7 135.89,10.16 138.43,10.16 138.43,7.62 135.89,7.62 135.89,5.08 138.43,5.08 135.89,2.54 138.43,2.54 140.97,2.54 148.59,2.54 151.13,2.54 153.67,2.54 153.67,5.08 151.13,5.08 151.13,7.62 153.67,7.62 153.67,10.16 149.86,10.16 142.24,12.7
  pour Top: 134.62,36.83 134.62,1.27 156.21,1.27 156.21,36.83
  pour Top: 134.62,36.83 134.62,1.27 156.21,1.27 156.21,36.83
  pour Bottom: 134.62,36.83 134.62,1.27 156.21,1.27 156.21,36.83
N$13  (via drill 0.61)
  other vias: 59.69,17.78 62.23,17.78 64.77,17.78 67.31,17.78 69.85,17.78 72.39,17.78 74.93,17.78 77.47,17.78 77.47,20.32 74.93,20.32 72.39,20.32 69.85,20.32 67.31,20.32 68.58,22.86 67.31,25.4 69.85,25.4 72.39,25.4 74.93,25.4 77.47,25.4 71.12,22.86 73.66,22.86 76.2,22.86 68.58,12.06 65.41,10.79 71.75,10.79 71.75,4.45 65.41,4.45 68.58,3.17 73.03,7.62 64.14,7.62 59.69,15.24 62.23,15.24 64.77,15.24 67.31,15.24 69.85,15.24 72.39,15.24 74.93,15.24 77.47,15.24 77.47,12.7 74.93,12.7 72.39,12.7 62.23,12.7 59.69,12.7 59.69,10.16 62.23,10.16 62.23,7.62 59.69,7.62 59.69,5.08 62.23,5.08 59.69,2.54 62.23,2.54 64.77,2.54 72.39,2.54 74.93,2.54 77.47,2.54 77.47,5.08 74.93,5.08 74.93,7.62 77.47,7.62 77.47,10.16 74.93,10.16
  pour Top: 58.42,26.67 58.42,1.27 78.74,1.27 78.74,26.67
  pour Top: 58.42,26.67 58.42,1.27 78.74,1.27 78.74,26.67
  pour Bottom: 58.42,26.67 58.42,1.27 78.74,1.27 78.74,26.67
N$20
  Top 0.254: C6.2 53.47,90.3 27.94,64.77 U$2.8
N$21  (via drill 0.41)
  Top 0.254: v94.23,90.3 C5.2
  Bottom 0.254: v94.23,90.3 54.99,90.3 29.46,64.77 U$2.9
N$22
  Top 0.254: C5.1 95,87.5 93.34,89.15 82.55,89.15 81.92,89.79 56.01,89.79 30.99,64.77 U$2.10
N$48  (via drill 0.41)
  Top 0.254: v92.71,76.83 C22.1 | v98.55,70.99 95,70.99 94.49,70.48 U$4.20
  Bottom 0.254: v98.55,70.99 v92.71,76.83
N$172
  Top 0.254: K1.1 37.08,48.39 37.08,54.99 36.07,56.01 35.56,56.01 R169.1
N$219  (via drill 0.41)
  Top 0.254: X5.1 150.11,46.74 144.78,46.74 R6.2 | v137.79,60.2 U$7.7
  Bottom 0.254: v137.79,60.2 137.79,59.05 X5.1
N$220  (via drill 0.41)
  Top 0.254: X5.2 149.73,49.66 144.78,49.66 R6.1 | v139.06,60.2 U$7.6
  Bottom 0.254: v139.06,60.2 152.27,46.99 X5.2
N$278  (via drill 0.61)
  other vias: 2.54,33.02 5.08,33.02 7.62,33.02 10.16,33.02 12.7,33.02 15.24,33.02 17.78,33.02 20.32,33.02 22.86,33.02 25.4,33.02 27.94,33.02 30.48,33.02 33.02,33.02 35.56,33.02 38.1,33.02 40.64,33.02 43.18,33.02 43.18,30.48 40.64,30.48 38.1,30.48 35.56,30.48 33.02,30.48 30.48,30.48 27.94,30.48 25.4,30.48 22.86,30.48 20.32,30.48 17.78,30.48 15.24,30.48 12.7,30.48 10.16,30.48 7.62,30.48 5.08,30.48 2.54,30.48 17.78,27.94 15.24,27.94 12.7,27.94 10.16,27.94 7.62,27.94 5.08,27.94 2.54,27.94 2.54,25.4 5.08,25.4 7.62,25.4 10.16,25.4 12.7,25.4 15.24,25.4 15.24,22.86 12.7,22.86 10.16,22.86 7.62,22.86 5.08,22.86 2.54,22.86 2.54,20.32 5.08,20.32 7.62,20.32 10.16,20.32 12.7,20.32 15.24,20.32 15.24,17.78 12.7,17.78 10.16,17.78 7.62,17.78 5.08,17.78 2.54,17.78 2.54,15.24 5.08,15.24 7.62,15.24 10.16,15.24 12.7,15.24 15.24,15.24 15.24,12.7 12.7,12.06 9.53,10.79 15.88,10.79 17.14,7.62 8.26,7.62 9.53,4.45 15.88,4.45 12.7,3.17 10.16,12.7 7.62,12.7 5.08,12.7 2.54,12.7 2.54,10.16 5.08,10.16 5.08,7.62 2.54,7.62 2.54,5.08 5.08,5.08 5.08,2.54 2.54,2.54 7.62,2.54 17.78,2.54 20.32,2.54 22.86,2.54 22.86,5.08 20.32,5.08 20.32,7.62 22.86,7.62 22.86,10.16 20.32,10.16 22.86,12.7 20.32,12.7 17.78,12.7
  pour Top: 24.13,1.27 24.13,13.97 16.51,13.97 16.51,25.4 45.72,25.4 45.72,34.29 1.27,34.29 1.27,1.27
  pour Top: 24.13,1.27 24.13,13.97 16.51,13.97 16.51,25.4 45.72,25.4 45.72,34.29 1.27,34.29 1.27,1.27
  pour Bottom: 24.13,1.27 24.13,13.97 16.51,13.97 16.51,25.4 45.72,25.4 45.72,34.29 1.27,34.29 1.27,1.27
OSC1
  Top 0.254: 109.86,84.07 110.74,84.07 PROGRAM.1 | 109.86,84.07 99.31,84.07 98.55,84.84 98.3,84.84 U$5.3 | U$4.9 105.79,70.48 109.86,74.55 109.86,84.07
PGEC1  (via drill 0.41)
  Top 0.254: U$4.5 104.9,65.41 v106.05,66.55
  Bottom 0.254: v106.05,66.55 106.05,71.75 106.3,72.01 106.3,77.09 PROGRAM.2
PGED1  (via drill 0.41)
  Top 0.254: U$4.4 104.78,64.14 v106.17,65.53
  Bottom 0.254: v106.17,65.53 106.81,66.17 106.81,75.06 PROGRAM.3
RA0  (via drill 0.41)
  Top 0.254: U$4.2 104.27,61.59 v105.41,60.45 | v135.51,52.58 135.89,52.58 136.53,53.21 U$7.1
  Bottom 0.254: v105.41,60.45 105.41,57.28 110.11,52.58 v135.51,52.58
RA1  (via drill 0.41)
  Top 0.254: U$4.3 103,62.87 101.98,61.85 v101.98,61.09 | v134.75,51.82 137.03,51.82 137.79,52.58 U$7.2
  Bottom 0.254: v101.98,61.09 101.98,59.94 110.11,51.82 v134.75,51.82
RA3  (via drill 0.41)
  Top 0.254: U$4.10 104.9,71.75 v105.41,72.26 | v115.57,57.53 v113.41,59.69 | U$7.3 v139.06,55.12
  Bottom 0.254: v105.41,72.26 105.41,67.06 105.28,66.93 105.28,62.1 107.7,59.69 v113.41,59.69 | v115.57,57.53 136.65,57.53 v139.06,55.12
RA4  (via drill 0.41)
  Top 0.254: U$4.12 104.78,74.3 105.28,74.8 v105.41,74.8 | v154.94,77.47 154.94,67.94 140.34,53.34 U$7.4
  Bottom 0.254: v105.41,74.8 105.41,81.15 115.44,91.19 141.22,91.19 v154.94,77.47
RB2
  Top 0.254: R5.2 60.33,84.07 S2.3 60.45,84.07 66.67,84.07 S2.4 66.8,84.07 71.25,79.63 85.34,79.63 92.33,72.64 92.33,66.93 93.22,66.04 95.76,66.04 96.39,66.67 U$4.6
RB3  (via drill 0.41)
  Top 0.254: R4.1 74.3,84.07 S1.3 74.42,84.07 80.64,84.07 S1.4 | v100.46,67.94 U$4.7
  Bottom 0.254: v100.46,67.94 84.33,84.07 80.77,84.07 S1.4
RB4  (via drill 0.41)
  Top 0.254: v117.73,64.01 117.73,54.48 T2.1 | v108.08,73.91 105.16,73.91 104.27,73.03 U$4.11
  Bottom 0.254: v117.73,64.01 108.08,73.66 v108.08,73.91
RB5  (via drill 0.41)
  Top 0.254: v45.21,53.34 44.2,54.36 T1.1 | v102.11,77.6 102.87,77.6 103.63,76.83 U$4.14
  Bottom 0.254: v45.21,53.34 36.45,53.34 35.56,54.23 35.56,54.99 43.31,62.74 96.39,62.74 102.11,68.45 v102.11,77.6
RB6  (via drill 0.41)
  Top 0.254: v71.75,46.61 U$1.13 | v78.99,53.85 78.99,61.98 v90.42,73.41 | v91.69,74.68 93.85,76.83 U$4.15
  Bottom 0.254: v78.99,53.85 v71.75,46.61 | v91.69,74.68 v90.42,73.41
RB7  (via drill 0.41)
  Top 0.254: v73.03,46.61 U$1.12 | v80.26,53.85 80.26,62.1 v90.55,72.39 | v92.71,74.55 93.73,75.56 U$4.16
  Bottom 0.254: v80.26,53.85 v73.03,46.61 | v92.71,74.55 v90.55,72.39
RB8  (via drill 0.41)
  Top 0.254: v74.3,46.61 U$1.11 | v96.27,75.44 95.12,74.3 U$4.17
  Bottom 0.254: v74.3,46.61 81.53,53.85 98.42,53.85 101.22,56.64 101.22,66.8 102.87,68.45 102.87,77.98 102.49,78.36 99.19,78.36 v96.27,75.44
RB9  (via drill 0.41)
  Top 0.254: v75.56,46.61 U$1.10 | v82.04,53.09 82.04,62.74 v91.57,72.26 | v92.71,73.41 93.98,73.41 94.36,73.03 U$4.18
  Bottom 0.254: v82.04,53.09 v75.56,46.61 | v92.71,73.41 v91.57,72.26
RB10  (via drill 0.41)
  Top 0.254: v96.27,69.22 U$4.21
  Bottom 0.254: v96.27,69.22 36.83,69.22 31.37,63.75 24.38,63.75 23.37,64.77 U$2.5
RB11  (via drill 0.41)
  Top 0.254: v96.27,67.94 U$4.22
  Bottom 0.254: v96.27,67.94 48.9,67.94 44.2,63.25 23.5,63.25 21.97,64.77 U$2.4
RB12  (via drill 0.41)
  Top 0.254: U$4.23 93.85,66.67 92.96,67.56 92.96,72.14 93.22,72.39 95.76,72.39 97.03,73.66 v97.03,77.98
  Bottom 0.254: v97.03,77.98 97.03,88.65 94.61,91.06 49.4,91.06 24.13,65.79 21.46,65.79 20.45,64.77 U$2.3
RB13  (via drill 0.41)
  Top 0.254: U$4.24 93.85,65.41 82.8,54.36 82.8,52.7 82.42,52.32 79.38,52.32 v77.85,53.85
  Bottom 0.254: v77.85,53.85 46.86,53.85 45.59,52.58 36.45,52.58 31.11,57.91 31.11,62.36 30.73,62.74 20.95,62.74 18.92,64.77 U$2.2
RB14  (via drill 0.41)
  Top 0.254: U$4.25 93.73,64.14 v91.57,61.98 | v30.35,61.98 v43.69,61.98
  Bottom 0.254: v43.69,61.98 v91.57,61.98 | v30.35,61.98 20.19,61.98 17.4,64.77 U$2.1

### Text on the board
tValues: 12V | GND | NHD-C0216CZ-FSW-FBW-3V3 | GND | 12V | SOLAR JACKETS / BATTERY PROFILE BOARD / 2/27/13 REV 1